# Altium project debug.PRJPCB
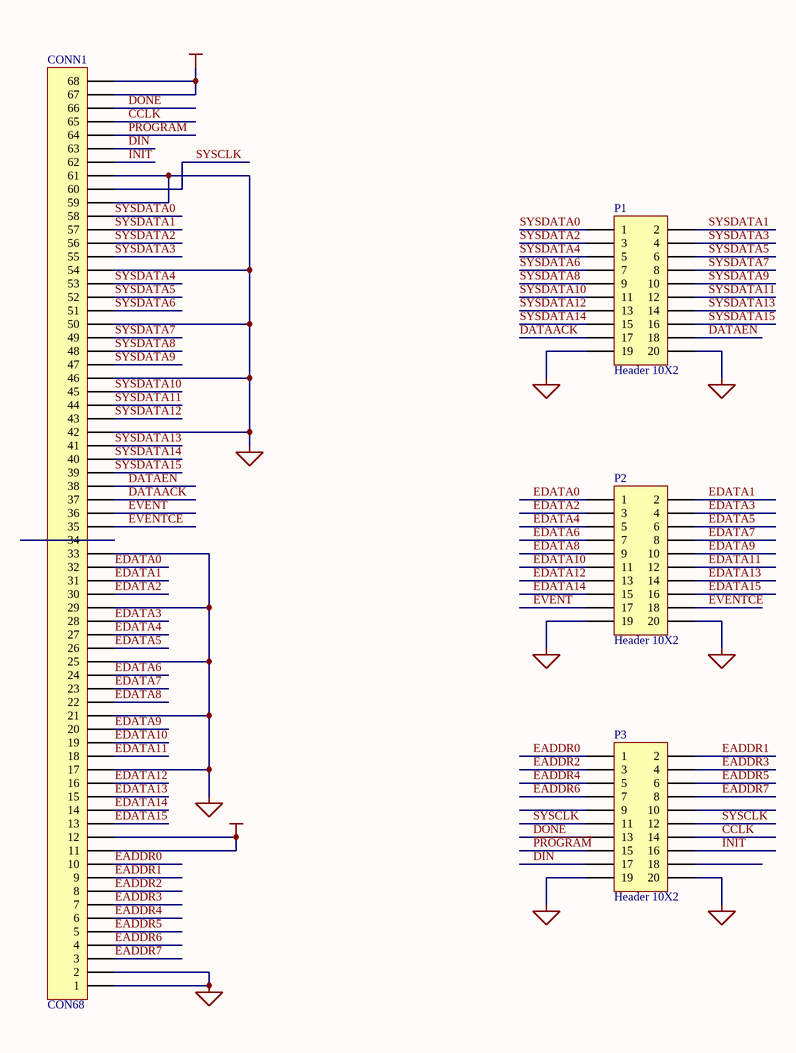
[diagram p0: debug.SCHDOC]
1 sheet, 4 parts. Net scope: global (net labels, ports and power ports of the same name join across sheets).
Board file: debug.PCBDOC

## Sheet debug.SCHDOC
size B

### Parts
CONN1  CON68  [MOLEX 71661-2068]
P1  Header 10X2  [HDR2X10]
P2  Header 10X2  [HDR2X10]
P3  Header 10X2  [HDR2X10]

### Nets
GND: CONN1.1 CONN1.2 CONN1.17 CONN1.21 CONN1.25 CONN1.29 CONN1.33 CONN1.42 CONN1.46 CONN1.50 CONN1.54 CONN1.59 CONN1.61 P1.19 P1.20 P2.19 P2.20 P3.19 P3.20
VCC: CONN1.11 CONN1.12 CONN1.67 CONN1.68
CCLK: CONN1.65 P3.14
DATAACK: CONN1.37 P1.17
DATAEN: CONN1.38 P1.18
DIN: CONN1.63 P3.17
DONE: CONN1.66 P3.13
EADDR0: CONN1.10 P3.1
EADDR1: CONN1.9 P3.2
EADDR2: CONN1.8 P3.3
EADDR3: CONN1.7 P3.4
EADDR4: CONN1.6 P3.5
EADDR5: CONN1.5 P3.6
EADDR6: CONN1.4 P3.7
EADDR7: CONN1.3 P3.8
EDATA0: CONN1.32 P2.1
EDATA1: CONN1.31 P2.2
EDATA2: CONN1.30 P2.3
EDATA3: CONN1.28 P2.4
EDATA4: CONN1.27 P2.5
EDATA5: CONN1.26 P2.6
EDATA6: CONN1.24 P2.7
EDATA7: CONN1.23 P2.8
EDATA8: CONN1.22 P2.9
EDATA9: CONN1.20 P2.10
EDATA10: CONN1.19 P2.11
EDATA11: CONN1.18 P2.12
EDATA12: CONN1.16 P2.13
EDATA13: CONN1.15 P2.14
EDATA14: CONN1.14 P2.15
EDATA15: CONN1.13 P2.16
EVENT: CONN1.36 P2.17
EVENTCE: CONN1.35 P2.18
INIT: CONN1.62 P3.16
~{PROGRAM}: CONN1.64 P3.15
SYSCLK: CONN1.60 P3.11 P3.12
SYSDATA0: CONN1.58 P1.1
SYSDATA1: CONN1.57 P1.2
SYSDATA2: CONN1.56 P1.3
SYSDATA3: CONN1.55 P1.4
SYSDATA4: CONN1.53 P1.5
SYSDATA5: CONN1.52 P1.6
SYSDATA6: CONN1.51 P1.7
SYSDATA7: CONN1.49 P1.8
SYSDATA8: CONN1.48 P1.9
SYSDATA9: CONN1.47 P1.10
SYSDATA10: CONN1.45 P1.11
SYSDATA11: CONN1.44 P1.12
SYSDATA12: CONN1.43 P1.13
SYSDATA13: CONN1.41 P1.14
SYSDATA14: CONN1.40 P1.15
SYSDATA15: CONN1.39 P1.16

Not connected (* = marked no-connect by the designer): CONN1 34; P3 9 10 18

### Library data of the parts
P1-P3 = Header 10X2: Header, 10-Pin, Dual row; LatestRevisionDate: 17-Jul-2002; LatestRevisionNote: Re-released for DXP Platform.; Publisher: Altium Limited